# EasyEDA Pro project DreamFly.eprj, board PCB4
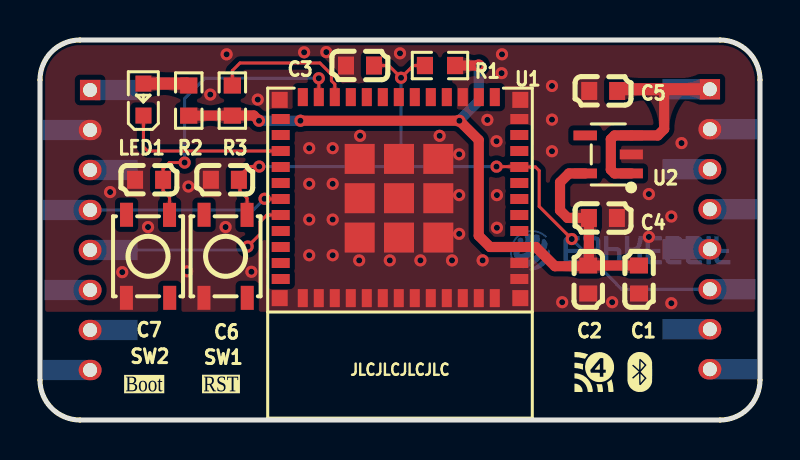
[diagram p10: board, top side]
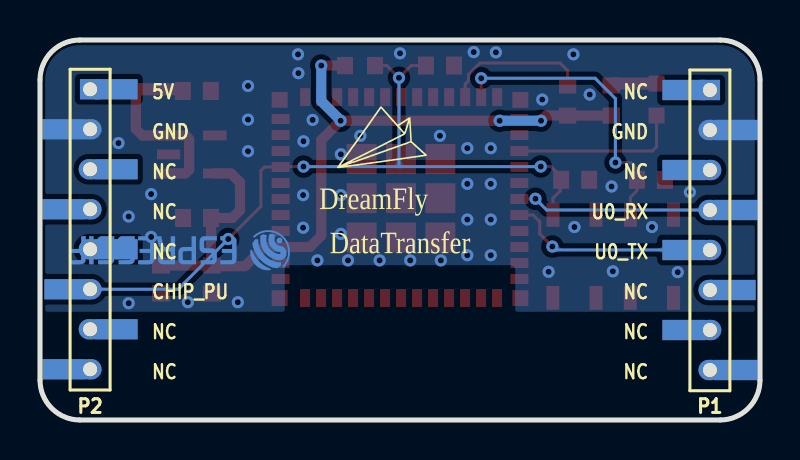
[diagram p11: board, bottom side, seen from below]

Outline 36 x 19 mm; copper layers: Top Layer, Bottom Layer. Coordinates in mm from the lower left corner of the outline.
Outline path: 0,17 0,2 arc(0.59,0.59) 2,0 34,0 arc(35.41,0.59) 36,2 36,17 arc(35.41,18.41) 34,19 2,19 arc(0.59,18.41) 0,17
Stack: Top Layer 0.035mm / Dielectric1 1.51mm FR4 er 4.5 / Bottom Layer 0.035mm

## Design rules (mm)
template: 自定义配置
spacing copperThickness1oz (default): track to track 0.102, other pairs 0 to 0.3
spacing copperThickness2oz: track to track 0.203, other pairs 0.152 to 0.3
track width copperThickness1oz (default): min 0.127, default 0.152, max 2.54
track width copperThickness2oz: min 0.203, default 0.254, max 2.54
differential pair differentialPair (default): width min 0.127, default 0.254, max 2.54; gap min 0.152, default 0.152
via viaSize (default): diameter min 0.5, default 0.61, max 10; hole min 0.3, default 0.305, max 6.299

## Placement (name value [footprint] x y rotation side)
C1  10uF  [C0603]  29.95 7.02 270 top
C2  100nF  [C0603]  27.41 7.02 270 top
C3  1uF  [C0603]  16 17.72 0 top
C4  1uF  [C0603]  28.14 10.1 180 top
C5  1uF  [C0603]  28.16 16.45 0 top
C6  100nF  [C0603]  9.24 12.01 0 top
C7  100nF  [C0603]  5.45 12.01 0 top
LED1  NCD0603B1  [LED0603-RD]  5.17 16.02 90 top
P1  -  [header10-2.0mm#2]  2.51 9.5 270 bottom
P2  -  [header10-2.0mm]  33.49 9.5 90 bottom
R1  10kΩ  [R0603]  20 17.72 0 top
R2  4.7kΩ  [R0603]  7.44 15.97 270 top
R3  10kΩ  [R0603]  9.62 15.97 270 top
SW1  PTS810SJS250SMTRLFS  [SW-SMD_4P_PTS810SJM250SMTRLFS]  9.28 8.19 90 top
SW2  PTS810SJS250SMTRLFS  [SW-SMD_4P_PTS810SJM250SMTRLFS]  5.4 8.19 90 top
U1  ESP8684-MINI-1-H4  [WIFI-SMD_ESP8684-MINI-1]  18 11.12 180 top
U2  ME6211C33M5G-N  [SOT-23-5_L3.0-W1.7-P0.95-LS2.8-BL]  28.41 13.28 90 top

## Footprints (pads in the part's own frame, mm; a bottom-side part is the same pattern mirrored in y, then rotated)
C0603
  rect 0.8x0.9 smd: 1(-0.7,0) 2(0.7,0)
header10-2.0mm
  rect 1.016x2.159 smd: 1(7.037,-1.297) 2(5.037,1.297) 3(3.037,-1.297) 4(1.037,1.297) 5(-0.963,-1.297) 7(-4.963,-1.297) 8(-6.963,1.297)
  rect 1.016x1.016 hole 0.7: 1(7.037,0)
  oval 1.016x1.143 hole 0.7: 2(5.037,0) 3(3.037,0) 4(1.037,0) 5(-0.963,0) 6(-2.963,0) 7(-4.963,0) 8(-6.963,0)
  rect 1.016x2.286 smd: 6(-2.963,1.145)
header10-2.0mm#2
  rect 1.016x2.159 smd: 1(-7,-1.297) 2(-5,1.297) 3(-2.999,-1.297) 4(-1,1.297) 5(1,-1.297) 7(5,-1.297) 8(7,1.297)
  rect 1.016x1.016 hole 0.7: 1(-7,0)
  oval 1.016x1.143 hole 0.7: 2(-5,0) 3(-2.999,0) 4(-1,0) 5(1,0) 6(3.001,0) 7(5,0) 8(7,0)
  rect 1.016x2.286 smd: 6(3.001,1.145)
LED0603-RD
  rect 0.8x0.8 smd: 1(-0.799,0) 2(0.799,0)
R0603
  rect 0.806x0.864 smd: 1(-0.753,0) 2(0.753,0)
SOT-23-5_L3.0-W1.7-P0.95-LS2.8-BL
  rect 0.49x1.157 smd: 1(-0.95,-1.153) 2(0,-1.153) 3(0.95,-1.153)
  rect 0.49x1.175 smd: 4(0.95,1.153) 5(-0.95,1.153)
SW-SMD_4P_PTS810SJM250SMTRLFS
  rect 1.2x0.65 smd: 1(-2.078,1.083) 2(2.078,1.075) 3(-2.077,-1.083) 4(2.071,-1.075)
WIFI-SMD_ESP8684-MINI-1
  rect 0.9x0.5 smd: 1(-5.965,4.069) 2(-5.965,3.269) 3(-5.965,2.469) 4(-5.965,1.669) 5(-5.965,0.869) 6(-5.965,0.069) 7(-5.965,-0.731) 8(-5.965,-1.531) 9(-5.965,-2.331) 10(-5.965,-3.131) 11(-5.965,-3.931) 25(5.965,-3.931) 26(5.965,-3.131) 27(5.965,-2.331) 28(5.965,-1.531) 29(5.965,-0.731) 30(5.965,0.069) 31(5.965,0.869) 32(5.965,1.669) 33(5.965,2.469) 34(5.965,3.269) 35(5.965,4.069)
  rect 0.5x0.9 smd: 12(-4.74,-5.025) 13(-3.94,-5.025) 14(-3.14,-5.025) 15(-2.34,-5.025) 16(-1.54,-5.025) 17(-0.74,-5.025) 18(0.06,-5.025) 19(0.86,-5.025) 20(1.66,-5.025) 21(2.46,-5.025) 22(3.26,-5.025) 23(4.06,-5.025) 24(4.86,-5.025) 36(4.86,5.025) 37(4.06,5.025) 38(3.26,5.025) 39(2.46,5.025) 40(1.66,5.025) 41(0.86,5.025) 42(0.06,5.025) 43(-0.74,5.025) 44(-1.54,5.025) 45(-2.34,5.025) 46(-3.14,5.025) 47(-3.94,5.025) 48(-4.74,5.025)
  rect 1.5x1.5 smd: 49(-1.916,1.996) 49(-1.916,0.03) 49(-1.916,-1.936) 49(0.05,1.996) 49(0.05,0.03) 49(0.05,-1.936) 49(2.016,1.996) 49(2.016,0.03) 49(2.016,-1.936)
  rect 0.8x0.8 smd: 50(6.015,5.025) 51(6.015,-4.887) 52(-6.015,-4.887) 53(-6.015,5.025)

## Nets
As in the schematic.

Pads without a net: P1 1 3 6 7 8; P2 3 4 5 7 8; SW1 2 3; SW2 2 3; U1 4 5 6 7 9 10 12 13 15 16 17 18 19 20 21 24 25 26 28 29 32 33 34 35; U2 4

## Via types
v1: diameter 0.61, hole 0.305, Top Layer to Bottom Layer, 59 vias

## Routing (per net, layer and track width the routed paths; a pad name or vN(x,y) marks a point on that pad's centre or on a via; arc(x,y) is an arc through that point)
3V3: length 39.6
  Top Layer w0.508: U2.5 26.45,12.33 26,11.88 26,10.48 26.38,10.1 C4.2 27.44,7.76 C2.1 ; C2.1 C1.1 ; C2.1 27.38,7.69 25.75,7.69 24.79,8.65 U1.3 22.5,8.65 21.94,9.21 21.94,14 v1(20.97,14.96) v1(13.02,14.96) ; R2.2 R3.2 9.62,15.22 10.69,15.22 v1(10.95,14.96) ; R1.2 v1(21.94,17.72)
  Bottom Layer w0.508: v1(21.94,17.72) 21.94,15.94 20.97,14.98 v1(20.97,14.96) ; v1(13.02,14.96) v1(10.95,14.96)
5V: length 12.2
  Top Layer w0.508: U2.1 28.73,12.33 28.54,12.52 28.54,14.04 28.73,14.23 U2.3 30.89,14.23 31.21,14.55 31.21,16.53 31.22,16.54
  Top Layer w0.61: C5.2 28.94,16.54 P2.1
GND:
  vias: v1(3.51,11.4) v1(4.11,7.39) v1(5.4,9.65) v1(7.42,11.67) v1(7.36,7.43) v1(8.51,16.27) v1(9.33,18.28) v1(9.28,9.65) v1(10.57,7.41) v1(10.89,16.02) v1(13.21,18.39) v1(13.46,13.59) v1(13.46,11.81) v1(13.46,10.02) v1(13.46,8.24) v1(14.31,18.4) v1(14.63,13.59) v1(14.63,11.81) v1(14.63,10.02) v1(14.63,8.24) v1(16,14.21) v1(15.96,7.98) v1(17.49,7.98) v1(18,18.33) v1(19.02,7.98) v1(19.98,14.21) v1(20.6,7.98) v1(20.96,13.28) v1(20.96,11.25) v1(20.96,9.31) v1(22.13,7.98) v1(22.37,15) v1(22.83,13.94) v1(22.84,11.25) v1(22.84,9.61) v1(23.1,18.28) v1(23.08,17.34) v1(25.6,16.7) v1(25.6,15.02) v1(25.6,13.44) v1(26.11,5.89) v1(28.61,5.89) v1(30.44,11.3) v1(30.44,9.15) v1(31.57,10.17) v1(31.57,5.84) v1(32.08,13.85)
CHIP_PU: length 36.9
  Top Layer w0.152: R1.1 18.66,17.72 v1(18.05,17.11) 17.44,17.72 C3.2 ; v1(26.59,9.05) 24.96,10.68 24.96,12.47 24.78,12.65 U1.8 23.95,12.67 v1(22.83,12.67) ; SW1.4 10.35,11.09 9.99,11.45 9.99,12.22 10.45,12.67 v1(10.96,12.67)
  Bottom Layer w0.152: v1(10.96,12.67) 10.97,12.67 18,12.67 ; v1(26.59,9.05) 28.83,6.81 28.83,6.78 29.07,6.54 P2.6 ; 18,12.67 18.05,12.72 v1(18.05,17.11) ; 18,12.67 v1(22.83,12.67)
GPIO8: length 7.5
  Top Layer w0.152: U1.22 14.74,16.79 14.57,16.96 14.57,17.28 14,17.85 10,17.85 9.62,17.47 9.62,16.47
GPIO9: length 14.9
  Top Layer w0.152: U1.23 v1(13.94,17.09) ; v1(7.23,12.87) 6.47,12.87 6.15,12.56 C7.2 6.15,11.46 6.48,11.14 SW2.4
  Bottom Layer w0.152: v1(7.23,12.87) 7.23,16.07 8.25,17.09 v1(13.94,17.09)
GPIO19: length 8.5
  Top Layer w0.152: LED1.1 5.17,13.66 5.38,13.45 U1.27
U0_RX: length 9.8
  Top Layer w0.152: U1.30 11.24,11.05 v1(11.23,11.06)
  Bottom Layer w0.152: P1.4 10.66,10.5 v1(11.23,11.06)
U0_TX: length 10.6
  Top Layer w0.152: v1(10.38,8.67) 11.01,9.3 11.01,9.92 11.34,10.25 U1.31
  Bottom Layer w0.152: v1(10.38,8.67) 10.21,8.5 2.51,8.5 P1.5
$1N6267: length 2.3
  Top Layer w0.61: LED1.2 7.34,16.82 7.44,16.72

## Copper pours and planes (outline as drawn; the poured copper is in the pictures)
GND on Top Layer: -5.88,21.41 42.13,21.41 42.13,-2.72 -5.88,-2.72
GND on Bottom Layer: -5.62,21.41 42.38,21.41 42.38,-2.72 -5.62,-2.72

Small or netless copper shapes (teardrops, artwork), in the pictures only: 32 on Bottom Layer, 44 on Top Layer

## Text on the board
Bottom Silkscreen Layer: 5V | GND | NC | CHIP_PU | U0_RX | U0_TX | DataTransfer | DreamFly
Top Silkscreen Layer: JLCJLCJLCJLC | Boot | RST
